# EasyEDA Pro project ProPrj_基于STM32单片机自带校准和温湿度补偿报警的超声波测距仪_2025-01-02.epro, board PCB
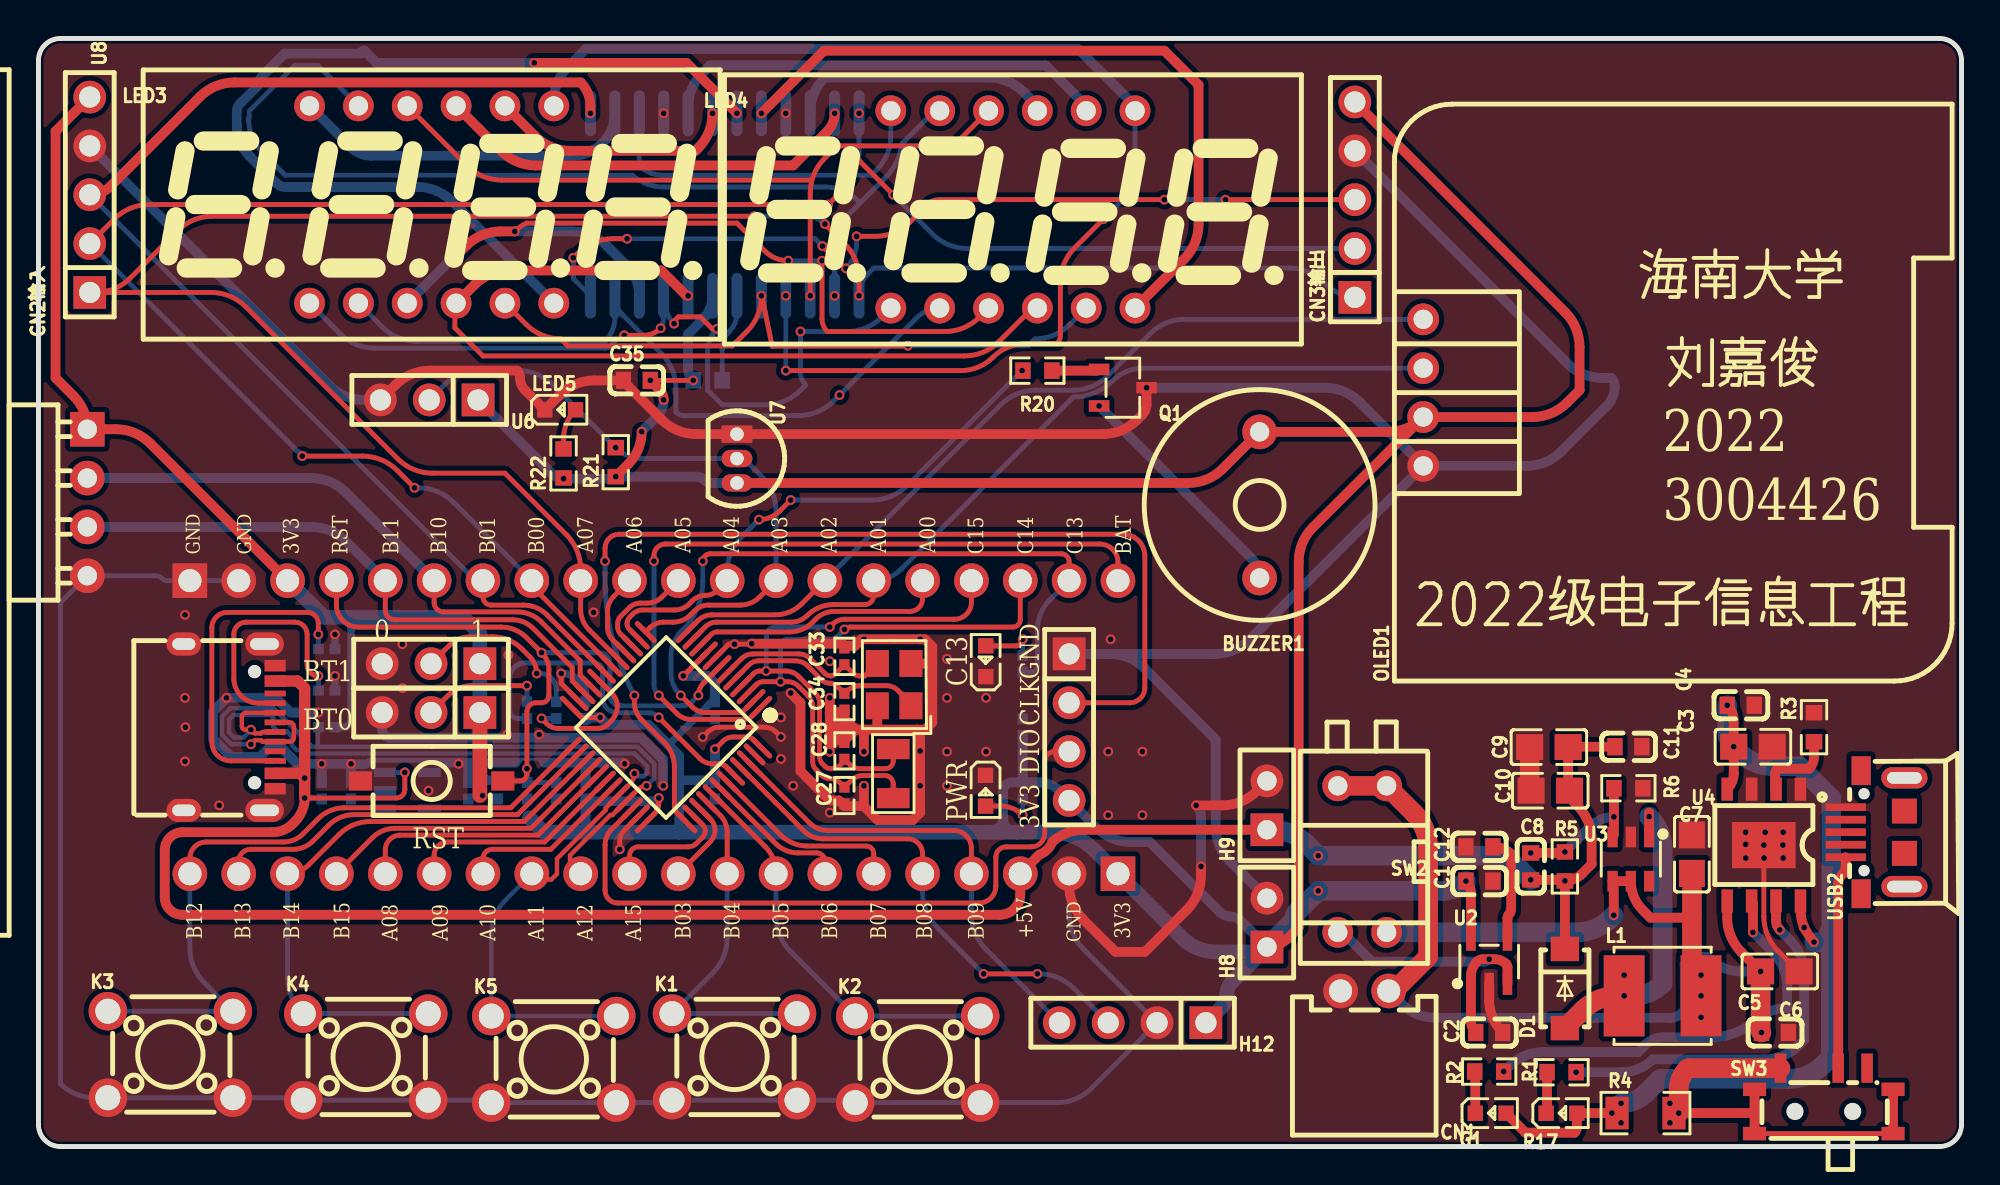
[diagram p1: board, top side]
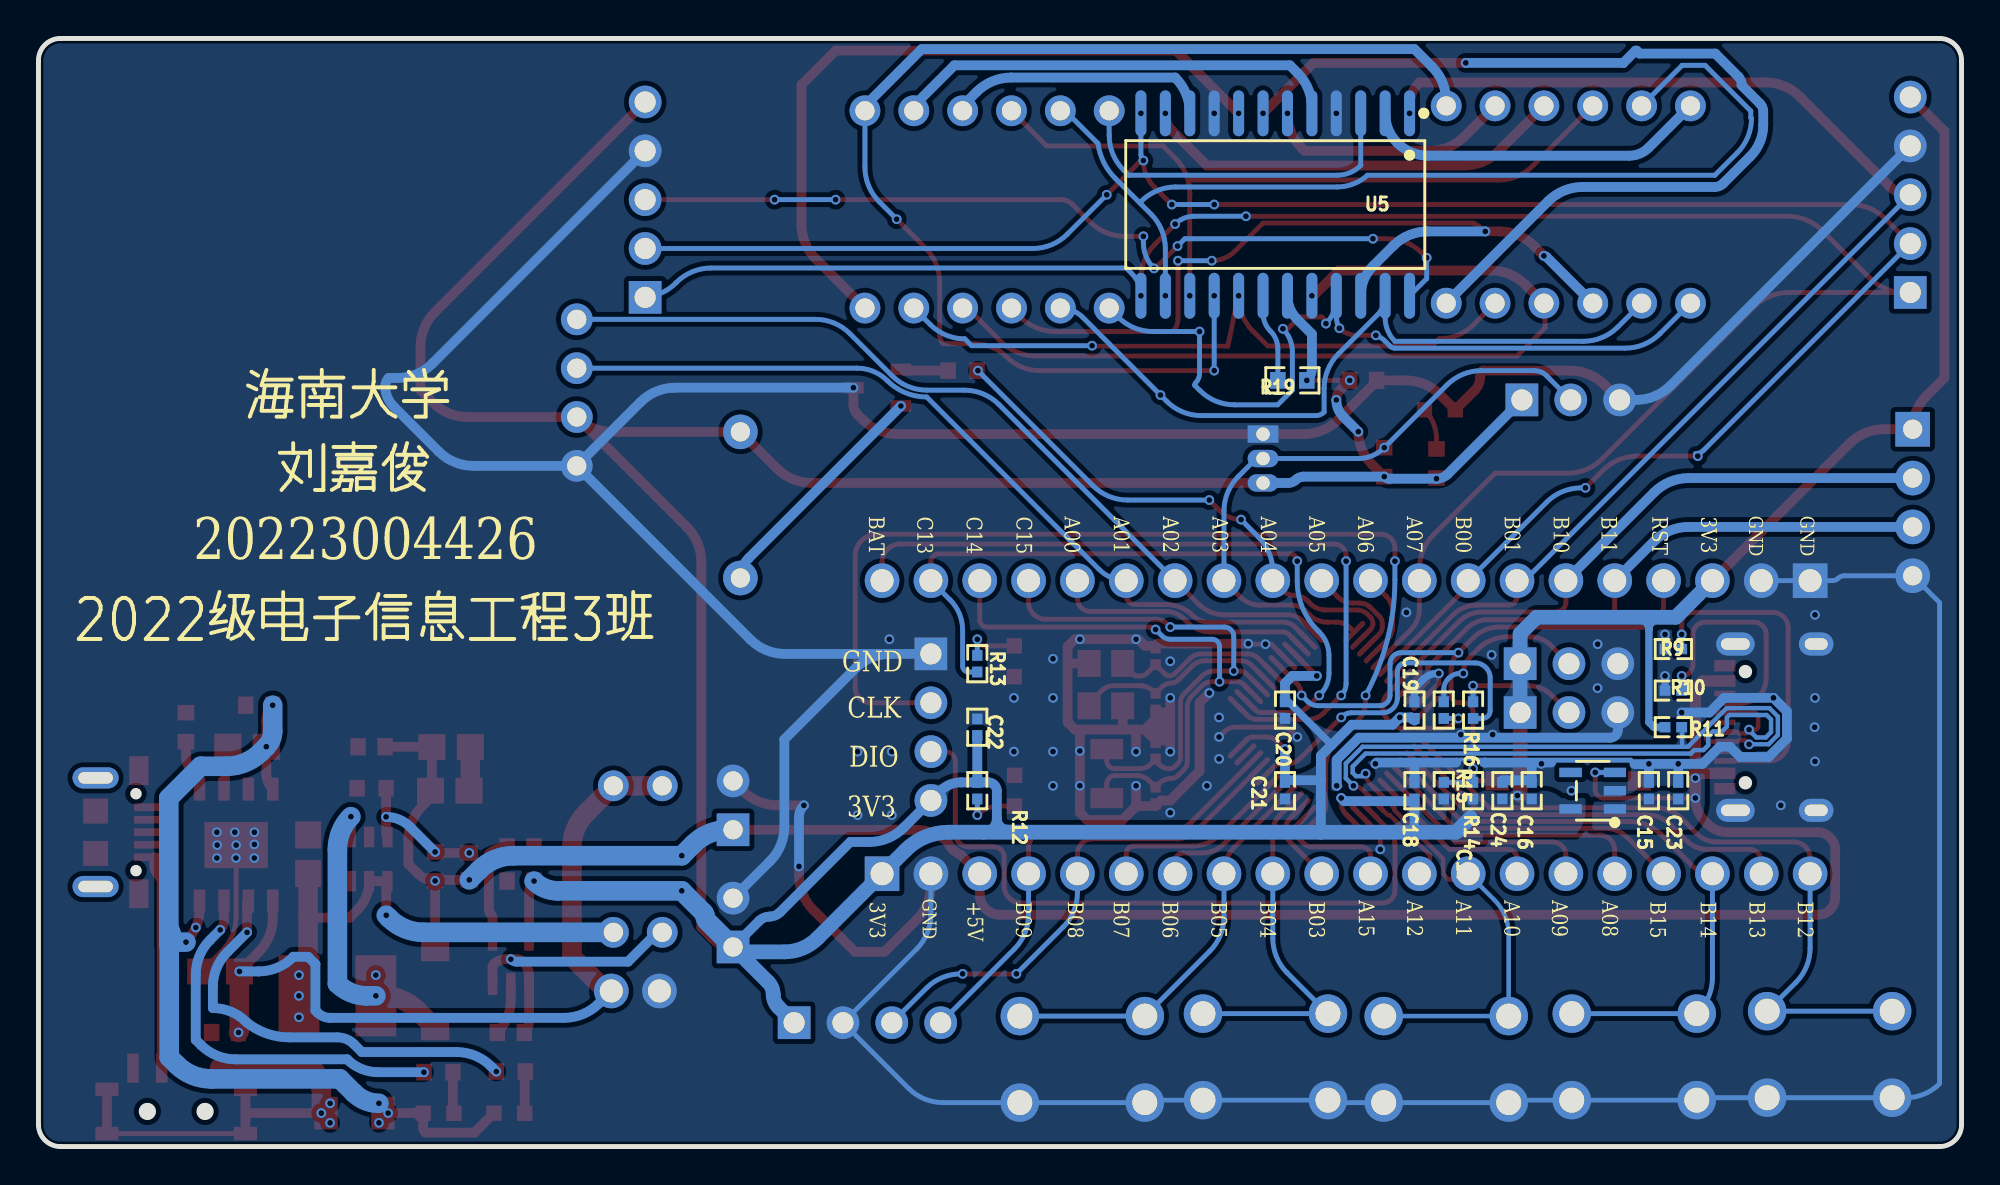
[diagram p2: board, bottom side, seen from below]

Outline 100 x 57.62 mm; copper layers: Top Layer, Bottom Layer. Coordinates in mm from the lower left corner of the outline.
Outline path: 0,56.48 0,1.14 arc(0.33,0.33) 1.14,0 98.86,0 arc(99.67,0.33) 100,1.14 100,56.48 arc(99.67,57.29) 98.86,57.62 1.14,57.62 arc(0.33,57.29) 0,56.48
Stack: Top Layer 0.035mm - / Dielectric1 1.51mm FR4 er 4.5 / Bottom Layer 0.035mm -

## Design rules (mm)
net USB_D-_PA11: DP1
net USB_D+_PA12: DP1
template: 自定义配置
spacing copperThickness1oz (default): track to track 0.102, other pairs 0.152 to 0.3
spacing copperThickness2oz: track to track 0.203, other pairs 0.152 to 0.3
track width copperThickness1oz (default): min 0.152, default 0.254, max 2.54
track width copperThickness2oz: min 0.152, default 0.254, max 2.54
differential pair differentialPair (default): width min 0.229, default 0.229, max 0.229; gap min 0.127, default 0.127
via viaSize (default): diameter min 0.508, default 0.508, max 0.508; hole min 0.305, default 0.305, max 0.305

## Placement (name value [footprint] x y rotation side)
BUZZER1  2.7kHz  [BUZ-TH_BD12.0-P7.60-D0.6-FD]  63.5 33.36 270 top
C1  1uF  [C0603]  74.93 13.81 180 top
C2  1uF  [C0603]  75.44 5.93 180 top
C3  10uF  [C0805]  89.15 20.79 180 top
C4  100nF  [C0603]  88.52 22.95 180 top
C5  10uF  [C0805]  90.55 9.11 180 top
C6  100nF  [C0603]  90.3 5.93 180 top
C7  22uF  [C0805]  85.98 15.2 270 top
C8  22pF  [C0603]  77.6 14.57 270 top
C9  22uF  [C0805]  78.54 20.77 0 top
C10  22uF  [C0805]  78.61 18.5 0 top
C11  100nF  [C0603]  82.68 20.79 180 top
C12  22nF  [C0603]  74.93 15.58 0 top
C15  100nF  [R0402]  16.26 18.5 270 bottom
C16  100nF  [R0402]  22.35 18.5 270 bottom
C17  100nF  [R0402]  26.92 18.5 90 bottom
C18  100nF  [R0402]  28.45 18.5 270 bottom
C19  100nF  [R0402]  28.45 22.7 270 bottom
C20  100nF  [R0402]  35.18 22.7 90 bottom
C21  100nF  [R0402]  35.18 18.5 90 bottom
C22  100nF  [R0402]  51.18 21.81 270 bottom
C23  1uF  [R0402]  14.73 18.5 270 bottom
C24  1uF  [R0402]  23.88 18.5 270 bottom
C27  12pF  [R0402]  41.91 18.25 90 top
C28  12pF  [R0402]  41.91 20.58 270 top
C33  12pF  [R0402]  41.91 25.49 270 top
C34  12pF  [R0402]  41.91 23.13 270 top
C35  100nF  [C0603]  31.12 39.84 0 top
CN1  XH-2AW  [CONN-TH_2P-P2.50_XH-2AW]  68.96 8.09 180 top
CN2输入  HC-PZ254-11.5L-1x5PZ  [HDR-TH_5P-P2.54-V-M]  2.67 49.49 90 top
CN3输出  HC-PZ254-11.5L-1x5PZ  [HDR-TH_5P-P2.54-V-M]  68.45 49.24 90 top
D1  SS34  [DO-214AC_L4.3-W2.7-LS5.3-FD]  79.38 8.22 90 top
G1  NCD0603G1  [LED_0603]  75.56 1.74 0 top
H1  DZ254W-11-04-65  [HDR-TH_4P-P2.54-V-M]  53.59 21.81 270 top
H2  2.54-1*20P直针  [HDR-TH_20P-P2.54-V-M-1]  32 29.43 0 top
H3  PZ254V-11-03P  [HDR-TH_3P-P2.54-V-M]  20.41 22.57 180 top
H4  PZ254V-11-03P  [HDR-TH_3P-P2.54-V-M]  20.41 25.11 180 top
H5  2.54-1*20P直针  [HDR-TH_20P-P2.54-V-M-1]  32 14.19 180 top
H8  2.54-1*2P母  [HDR-TH_2P-P2.54-V-F]  63.88 11.65 90 top
H9  2.54-1*2P母  [HDR-TH_2P-P2.54-V-F]  63.88 17.74 90 top
H12  2.54-1*4P母  [HDR-TH_4P-P2.54-V-F]  56.9 6.44 180 top
K1  TSWDIP-6*6*6  [KEY-TH_4P-L6.0-W6.0-P4.50-LS6.50]  36.19 4.66 0 top
K2  TSWDIP-6*6*6  [KEY-TH_4P-L6.0-W6.0-P4.50-LS6.50]  45.72 4.53 0 top
K3  TSWDIP-6*6*6  [KEY-TH_4P-L6.0-W6.0-P4.50-LS6.50]  6.86 4.79 0 top
K4  TSWDIP-6*6*6  [KEY-TH_4P-L6.0-W6.0-P4.50-LS6.50]  17.02 4.66 0 top
K5  TSWDIP-6*6*6  [KEY-TH_4P-L6.0-W6.0-P4.50-LS6.50]  26.8 4.53 0 top
L1  2.2uH  [IND-SMD_L5.0-W5.0]  84.46 7.84 0 top
LDO1  ME6211C33M5G-N  [SOT-23-5_L3.0-W1.7-P0.95-LS2.8-BL]  19.18 18.5 90 bottom
LED1  NCD0603R1  [LED_0603]  49.25 18.45 270 top
LED2  NCD0603B1  [LED_0603]  49.25 25.29 90 top
LED3  MHDA3641SRBW  [LED-SEG-TH_12P-L30.0-W14.0-P2.54-S10.26-BL]  20.45 48.98 0 top
LED4  MHDA3641SRBW  [LED-SEG-TH_12P-L30.0-W14.0-P2.54-S10.26-BL]  50.67 48.73 0 top
LED5  KT-0603R  [LED_0603]  27.18 38.32 0 top
OLED1  HS96L03W2C03  [0.96OLED_4P]  72.01 39.2 90 top
Q1  S8550  [SOT-23-3_L2.9-W1.6-P1.90-LS2.8-BR]  56.39 39.46 180 top
R1  3.3kΩ  [R0603_NEW]  79.2 3.87 0 top
R2  10kΩ  [R0603_NEW]  75.44 3.9 0 top
R3  1.2kΩ  [R0603_NEW]  92.33 21.81 270 top
R4  250mΩ  [R1206]  83.57 1.74 180 top
R5  440kΩ  [R0603_NEW]  79.38 14.57 90 top
R6  60kΩ  [R0603_NEW]  82.68 18.63 180 top
R9  5.1kΩ  [R0402]  14.99 25.87 0 bottom
R10  5.1kΩ  [R0402]  14.99 23.71 0 bottom
R11  1.5kΩ  [R0402]  14.99 21.81 0 bottom
R12  1kΩ  [R0402]  51.18 18.5 90 bottom
R13  1kΩ  [R0402]  51.18 25.11 270 bottom
R14  10kΩ  [R0402]  25.4 18.5 270 bottom
R15  10kΩ  [R0402]  26.92 22.7 90 bottom
R16  10kΩ  [R0402]  25.4 22.7 270 bottom
R17  KT-0603R  [LED_0603]  79.25 1.74 0 top
R19  10kΩ  [R0603]  34.8 39.84 0 bottom
R20  1kΩ  [R0603]  51.94 40.35 0 top
R21  10kΩ  [R0603]  30.02 35.59 90 top
R22  1kΩ  [R0603]  27.31 35.52 90 top
SW1  TS-1101-B-W  [KEY-SMD_2P-L6.0-W3.6-P7.4-LS8.0-L]  20.45 19.01 0 top
SW2  DSDP02LHGET  [SW-TH_DSDP02LHG]  68.83 14.95 180 top
SW3  MSK12C02-HB  [SW-TH_MSK12C02-HB]  92.84 2.38 0 top
U1  STM32F103C8T6  [LQFP-48_L7.0-W7.0-P0.50-LS9.0-BL]  32.64 21.81 135 top
U2  RT9193-33GB  [SOT-23-5_L3.0-W1.7-P0.95-LS2.8-BL]  75.44 9.61 0 top
U3  MST9220BSF  [SOT-23-6_L2.9-W1.6-P0.95-LS2.8-BL]  82.8 14.95 180 top
U4  TP4056-42-ESOP8  [ESOP-8_L4.9-W3.9-P1.27-LS6.0-BL-EP]  89.72 15.68 180 top
U5  MAX7219CWG+  [SOIC-24_L15.4-W7.5-P1.27-LS10.3-BL]  35.69 48.98 0 bottom
U6  HC-PZ254-11.5L-1x3PZ  [HDR-TH_3P-P2.54-V-M]  20.32 38.82 180 top
U7  DS18B20  [TO-92-3_L4.9-W3.7-P1.27-L]  36.32 35.78 270 top
U8  HC-SR04  [TH_HC-SR04V]  2.54 33.49 270 top
USB1  TYPE-C 16PIN 2MD(073)  [USB-C-SMD_TYPE-C-6PIN-2MD-073]  9.93 21.81 270 top
USB2  MICRO5.9mmusb  [MICRO-USB-SMD_5P-P0.65-H-F_MICRO5.9MMUSB]  95.5 16.34 90 top
X3  8MHz  [CRYSTAL-SMD_4P-L3.2-W2.5-BL-1]  44.5 24.02 90 top
X5  32.768kHz  [OSC-SMD_L3.2-W1.5]  44.45 19.39 90 top

## Footprints (pads in the part's own frame, mm; a bottom-side part is the same pattern mirrored in y, then rotated)
0.96OLED_4P
  round 1.65 hole 1: 1(-3.81,-0.002) 2(-1.27,0.002) 3(1.27,0.002) 4(3.81,0.002)
BUZ-TH_BD12.0-P7.60-D0.6-FD
  round 1.8 hole 1: 1(-3.8,0) 2(3.8,0)
C0603
  rect 0.8x0.9 smd: 1(-0.7,0) 2(0.7,0)
C0805
  rect 1.41x1.35 smd: 1(-1,0) 2(1,0)
CONN-TH_2P-P2.50_XH-2AW
  round 1.8 hole 1.199: 1(-1.251,0) 2(1.251,0)
CRYSTAL-SMD_4P-L3.2-W2.5-BL-1
  rect 1.4x1.2 smd: 1(-1.1,-0.875) 2(1.1,-0.875) 3(1.1,0.875) 4(-1.1,0.875)
DO-214AC_L4.3-W2.7-LS5.3-FD
  rect 1.27x1.47 smd: 1(-2.058,0) 2(2.058,0)
ESOP-8_L4.9-W3.9-P1.27-LS6.0-BL-EP
  rect 0.6x1.2 smd: 1(-1.905,-2.909) 2(-0.635,-2.909) 3(0.635,-2.909) 4(1.905,-2.909) 5(1.905,2.909) 6(0.635,2.909) 7(-0.635,2.909) 8(-1.905,2.909)
  rect 3.3x2.4 smd: 9(0,0)
HDR-TH_2P-P2.54-V-F
  rect 1.7x1.7 hole 1: 1(-1.27,0)
  round 1.7 hole 1: 2(1.27,0)
HDR-TH_3P-P2.54-V-M
  rect 1.7x1.7 hole 1.1: 1(-2.54,0)
  round 1.7 hole 1.1: 2(0,0) 3(2.54,0)
HDR-TH_4P-P2.54-V-F
  rect 1.7x1.7 hole 1.1: 1(-3.81,0)
  round 1.7 hole 1.1: 2(-1.27,0) 3(1.27,0) 4(3.81,0)
HDR-TH_4P-P2.54-V-M
  rect 1.7x1.7 hole 1.1: 1(-3.81,0)
  round 1.7 hole 1.1: 2(-1.27,0) 3(1.27,0) 4(3.81,0)
HDR-TH_5P-P2.54-V-M
  rect 1.7x1.7 hole 1.1: 1(-5.08,0)
  round 1.7 hole 1.1: 2(-2.54,0) 3(0,0) 4(2.54,0) 5(5.08,0)
HDR-TH_20P-P2.54-V-M-1
  rect 1.8x1.8 hole 1.2: 1(-24.13,0)
  round 1.8 hole 1.2: 2(-21.59,0) 3(-19.05,0) 4(-16.51,0) 5(-13.97,0) 6(-11.43,0) 7(-8.89,0) 8(-6.35,0) 9(-3.81,0) 10(-1.27,0) 11(1.27,0) 12(3.81,0) 13(6.35,0) 14(8.89,0) 15(11.43,0) 16(13.97,0) 17(16.51,0) 18(19.05,0) 19(21.59,0) 20(24.13,0)
IND-SMD_L5.0-W5.0
  rect 2.124x4.22 smd: 1(2,0) 2(-2,0)
KEY-SMD_2P-L6.0-W3.6-P7.4-LS8.0-L
  rect 1.2x1 smd: 1(-3.7,0) 2(3.7,0)
KEY-TH_4P-L6.0-W6.0-P4.50-LS6.50
  round 2 hole 1.3: 1(-3.25,2.25) 2(3.25,2.25) 3(-3.25,-2.25) 4(3.25,-2.25)
LED-SEG-TH_12P-L30.0-W14.0-P2.54-S10.26-BL
  round 1.6 hole 1: 1(-6.35,-5.13) 2(-3.81,-5.13) 3(-1.27,-5.13) 4(1.27,-5.13) 5(3.81,-5.13) 6(6.35,-5.13) 7(6.35,5.13) 8(3.81,5.13) 9(1.27,5.13) 10(-1.27,5.13) 11(-3.81,5.13) 12(-6.35,5.13)
LED_0603
  rect 0.8x0.8 smd: 1(-0.851,-0.01) 2(0.75,-0.005)
LQFP-48_L7.0-W7.0-P0.50-LS9.0-BL
  oval 0.27x1.5 smd: 1(-2.75,-4.25) 2(-2.25,-4.25) 3(-1.75,-4.25) 4(-1.25,-4.25) 5(-0.75,-4.25) 6(-0.25,-4.25) 7(0.25,-4.25) 8(0.75,-4.25) 9(1.25,-4.25) 10(1.75,-4.25) 11(2.25,-4.25) 12(2.75,-4.25) 25(2.75,4.25) 26(2.25,4.25) 27(1.75,4.25) 28(1.25,4.25) 29(0.75,4.25) 30(0.25,4.25) 31(-0.25,4.25) 32(-0.75,4.25) 33(-1.25,4.25) 34(-1.75,4.25) 35(-2.25,4.25) 36(-2.75,4.25)
  oval 1.5x0.27 smd: 13(4.25,-2.75) 14(4.25,-2.25) 15(4.25,-1.75) 16(4.25,-1.25) 17(4.25,-0.75) 18(4.25,-0.25) 19(4.25,0.25) 20(4.25,0.75) 21(4.25,1.25) 22(4.25,1.75) 23(4.25,2.25) 24(4.25,2.75) 37(-4.25,2.75) 38(-4.25,2.25) 39(-4.25,1.75) 40(-4.25,1.25) 41(-4.25,0.75) 42(-4.25,0.25) 43(-4.25,-0.25) 44(-4.25,-0.75) 45(-4.25,-1.25) 46(-4.25,-1.75) 47(-4.25,-2.25) 48(-4.25,-2.75)
MICRO-USB-SMD_5P-P0.65-H-F_MICRO5.9MMUSB
  rect 0.4x2.1 smd: 1(-1.3,1.525) 2(-0.65,1.525) 3(0,1.525) 4(0.65,1.525) 5(1.3,1.525)
  rect 1.5x1 smd: 6(-3.2,0.725) 6(3.2,0.725)
  oval 1.1x2.4 hole 0.6x1.8: 6(-2.825,-1.525) 6(2.825,-1.525)
  rect 1.3x1.3 smd: 6(-1.1,-1.525) 6(1.1,-1.525)
OSC-SMD_L3.2-W1.5
  rect 1.05x1.7 smd: 1(-1.275,0) 2(1.275,0)
R0402
  rect 0.566x0.54 smd: 1(-0.433,0) 2(0.433,0)
R0603
  rect 0.806x0.864 smd: 1(-0.753,0) 2(0.753,0)
R0603_NEW
  rect 0.806x0.864 smd: 1(-0.753,0) 2(0.753,0)
R1206
  rect 1.208x1.701 smd: 1(-1.479,0) 2(1.479,0)
SOIC-24_L15.4-W7.5-P1.27-LS10.3-BL
  oval 0.574x2.388 smd: 1(-6.985,-4.744) 2(-5.715,-4.744) 3(-4.445,-4.744) 4(-3.175,-4.744) 5(-1.905,-4.744) 6(-0.635,-4.744) 7(0.635,-4.744) 8(1.905,-4.744) 9(3.175,-4.744) 10(4.445,-4.744) 11(5.715,-4.744) 12(6.985,-4.744) 13(6.985,4.744) 14(5.715,4.744) 15(4.445,4.744) 16(3.175,4.744) 17(1.905,4.744) 18(0.635,4.744) 19(-0.635,4.744) 20(-1.905,4.744) 21(-3.175,4.744) 22(-4.445,4.744) 23(-5.715,4.744) 24(-6.985,4.744)
SOT-23-3_L2.9-W1.6-P1.90-LS2.8-BR
  rect 1.07x0.6 smd: 1(1.235,-0.95) 2(1.235,0.95) 3(-1.235,0)
SOT-23-5_L3.0-W1.7-P0.95-LS2.8-BL
  rect 0.49x1.157 smd: 1(-0.95,-1.153) 2(0,-1.153) 3(0.95,-1.153)
  rect 0.49x1.175 smd: 4(0.95,1.153) 5(-0.95,1.153)
SOT-23-6_L2.9-W1.6-P0.95-LS2.8-BL
  rect 0.532x1.072 smd: 1(-0.95,-1.149) 2(0,-1.149) 3(0.95,-1.149) 4(0.95,1.149) 5(0,1.149) 6(-0.95,1.149)
SW-TH_DSDP02LHG
  round 1.6 hole 1: 1(-1.27,-3.81) 2(1.27,-3.81) 3(1.27,3.81) 4(-1.27,3.81)
SW-TH_MSK12C02-HB
  rect 0.6x1.524 smd: 1(-2.25,1.7) 2(0.75,1.7) 3(2.25,1.7)
  rect 1.2x0.7 smd: 4(-3.6,0.6) 4(-3.6,-1.7) 4(3.6,0.6) 4(3.6,-1.7)
TH_HC-SR04V
  rect 1.8x1.8 hole 1.001: 1(-3.81,0)
  round 1.8 hole 1.001: 2(-1.27,0) 3(1.27,0) 4(3.81,0)
TO-92-3_L4.9-W3.7-P1.27-L
  rect 0.9x1.6 hole 0.7: 1(-1.27,0)
  oval 0.9x1.6 hole 0.7: 2(0,0) 3(1.27,0)
USB-C-SMD_TYPE-C-6PIN-2MD-073
  rect 0.6x1.1 smd: 1(-3.2,2.375) 2(-2.4,2.375) 11(2.4,2.375) 12(3.2,2.375)
  rect 0.3x1.1 smd: 3(-1.75,2.375) 4(-1.25,2.375) 5(-0.75,2.375) 6(-0.25,2.375) 7(0.25,2.375) 8(0.75,2.375) 9(1.25,2.375) 10(1.75,2.375)
  oval 1.2x2 hole 0.6x1.5: 13(-4.325,1.825) 14(4.325,1.825)
  oval 1.2x1.8 hole 0.6x1.2: 13(-4.325,-2.375) 14(4.325,-2.375)

## Nets
As in the schematic, except:
3V3: BUZZER1.1 C1.2 C16.2 C18.2 C19.2 C20.2 C21.2 C22.2 C24.2 C35.2 CN2输入.5 CN3输出.5 H1.4 H2.3 H3.1 H4.1 H5.1 H8.1 H12.1 LDO1.5 OLED1.2 R11.2 R12.2 R14.2 R19.1 R21.1 R22.1 U1.9 U1.24 U1.36 U1.48 U2.5 U5.19 U6.1 U7.3 U8.1
GND: C1.1 C2.1 C3.1 C4.1 C5.1 C6.1 C7.1 C9.1 C10.1 C11.1 C12.1 C15.1 C16.1 C17.1 C18.1 C19.1 C20.1 C21.1 C22.1 C23.1 C24.1 C27.1 C28.1 C33.1 C34.2 C35.1 CN1.2 CN2输入.4 CN3输出.4 H1.1 H2.1 H2.2 H3.3 H4.3 H5.2 H8.2 H9.2 H12.2 K1.3 K1.4 K2.3 K2.4 K3.3 K3.4 K4.3 K4.4 K5.3 K5.4 LDO1.2 LED1.1 LED2.1 LED5.1 OLED1.1 Q1.3 R3.1 R6.1 R9.2 R10.2 SW1.1 U1.8 U1.23 U1.35 U1.47 U2.2 U3.2 U4.1 U4.3 U4.9 U5.4 U5.9 U6.3 U7.1 U8.4 USB1.1 USB1.12 USB1.13 USB1.14 USB2.5 X3.2 X3.4
PA1: H2.15 OLED1.3 U1.11
PA2: H2.14 OLED1.4 U1.12
R1_1: R1.1 R17.1
R2_1: G1.1 R2.1
U1_4: C3.2 C4.2 G1.2 R4.2 R17.2 U4.4 U4.8
USB_5V: R4.1 SW3.1 SW3.4

Pads without a net: LDO1 4; SW3 3; U3 6; USB1 3 9; USB2 2 3 4 6

## Via types
v1: diameter 0.508, hole 0.305, Top Layer to Bottom Layer, 185 vias

## Routing (per net, layer and track width the routed paths; a pad name or vN(x,y) marks a point on that pad's centre or on a via; arc(x,y) is an arc through that point)
3V3: length 302.6
  Top Layer w0.254: U1.48 37.17,21.17 arc(37.02,21.26) 36.85,21.3 36.13,21.3 arc(35.84,21.24) 35.59,21.08 v1(35.18,20.66) ; U1.36 32.03,17.31 arc(32.2,17.56) 32.26,17.85 v1(32.26,18.12) ; U1.24 28.24,22.31 v1(29.21,22.31) ; v1(31.81,39.84) v1(34.04,39.84)
  Top Layer w0.28: v1(33.53,24.47) 33.54,24.47 U1.9
  Top Layer w0.508: 71.98,37.91 66.28,32.2 arc(65.73,31.38) 65.53,30.41 65.53,11.39 64.97,10.83 arc(64.47,10.49) H8.1 ; 71.98,37.91 OLED1.2 77.69,37.94 arc(78.66,38.13) 79.48,38.68 80.14,39.33 80.14,41.58 arc(79.94,42.55) 79.39,43.38 CN3输出.5 ; 71.98,37.91 arc(71.16,37.36) 70.18,37.16 63.5,37.16 61.59,35.25 arc(60.76,34.7) 59.79,34.51 U7.3 ; H2.3 5.82,36.56 arc(5,37.11) 4.03,37.3 U8.1 arc(2.35,38.24) 1.82,39.03 0.89,39.97 0.89,52.78 arc(0.89,52.79) 0.9,52.8 CN2输入.5 ; v1(31.81,39.84) 32.29,39.37 arc(32.45,39.12) v1(32.51,38.82) ; v1(30.02,34.84) 30.67,35.49 arc(31.19,36.26) v1(31.37,37.17) ; U2.5 74.49,13.18 arc(74.42,13.52) v1(74.23,13.81)
  Top Layer w0.762: H3.1 22.95,18.25
  Bottom Layer w0.381: 15.42,21.81 16,21.81 16.26,22.06 16.26,26.89 ; 16.26,27.01 16.26,27.39 ; 16.26,27.01 16.26,26.89 ; 16.26,27.01 arc(16.14,27.28) 15.88,27.39 ; 16.26,26.89 arc(16.11,27.25) 15.75,27.39 ; 16.26,26.89 arc(16.4,27.25) 16.76,27.39 ; 35.18,23.24 35.11,23.24 32.77,20.89 32.77,20.87
  Bottom Layer w0.508: R12.2 50.61,18.94 arc(50.3,18.81) 50.16,18.49 50.16,17.05 ; R12.2 51.18,21.26 ; R12.2 52.03,18.94 arc(52.61,18.82) 53.09,18.5 H1.4 55.01,16.58 arc(55.83,16.03) 56.81,15.84 57.78,15.84 61.44,12.18 arc(61.69,12.02) 61.98,11.96 arc(62.27,11.9) 62.52,11.73 H8.1 ; 33.32,19.04 33.32,19.05 35.18,19.05 v1(35.18,20.66) ; 33.32,19.04 33.32,20.32 31.7,21.93 29.59,21.93 v1(29.21,22.31) 28.61,22.31 28.45,22.15 ; 33.32,19.04 33.32,16.34 ; U6.1 26.71,34.97 arc(26.98,34.79) v1(27.31,34.73) 29.76,34.73 arc(29.9,34.76) v1(30.02,34.84) 34.22,34.84 arc(34.43,34.79) 34.62,34.67 arc(34.8,34.55) 35.01,34.51 U7.3 ; 49.4,16.47 49.59,16.47 arc(50,16.64) 50.16,17.05 ; 28.45,16.34 28.45,17.96 32.09,17.96 v1(32.26,18.12) ; 35.18,23.24 35.18,24.09 34.8,24.47 v1(33.53,24.47) ; v1(31.37,37.17) 32.15,37.96 arc(32.42,38.35) v1(32.51,38.82) ; 50.16,17.05 50.16,16.47 ; 50.16,17.05 arc(50.37,16.55) 50.87,16.34 ; v1(34.04,39.84) arc(33.85,40.13) 33.78,40.47 33.78,42.25 34.55,43.02 arc(34.92,43.58) U5.19
  Bottom Layer w0.762: H2.3 14.86,27.52 22.1,27.52 22.95,26.67 H4.1 H3.1 ; H12.1 61.53,7.26 arc(61.72,7.56) 61.79,7.91 arc(61.86,8.26) 62.06,8.56 H8.1 arc(63.6,10.19) 63.27,10.12 61.21,10.12 arc(60.28,10.31) 59.48,10.84 H5.1 54.9,15.42 arc(53.88,16.11) 52.67,16.34 26.29,16.34 25.53,17.11
  Bottom Layer w1.016: H8.1 65.24,11.73 arc(65.31,11.83) 65.33,11.95 arc(65.35,12.07) 65.42,12.17 v1(66.55,13.3) 73,13.3 arc(73.67,13.43) v1(74.23,13.81)
  vias: v1(23.1,18.25)
+5V: length 118.6
  Top Layer w0.254: v1(13.84,18.12) 18.61,18.12 arc(18.92,18.25) 19.05,18.56 v1(19.05,19.45)
  Top Layer w0.508: H9.1 54.39,16.47 arc(53.5,16.31) 52.73,15.85 arc(52.46,15.44) 52.04,15.18 H5.3 51.05,13.11 arc(50.75,12.36) 50,12.05 7.47,12.05 arc(6.83,12.32) 6.57,12.95 6.57,15.42 arc(6.84,16.07) 7.49,16.34 12.17,16.34 arc(12.74,16.46) 13.21,16.78 13.34,16.9 arc(13.71,17.46) v1(13.84,18.12) ; v1(77.6,13.87) 79.25,13.87 arc(79.32,13.85) v1(79.38,13.81) ; C11.2 79.59,20.79 arc(79.56,20.79) C9.2 79.54,18.67 arc(79.56,18.58) C10.2 arc(79.68,18.17) 79.87,17.88 80.03,17.73 arc(80.58,16.9) 80.77,15.93 80.77,15.92 80.77,14.69 80.26,14.18 arc(79.85,13.91) v1(79.38,13.81) ; D1.2 v1(79.38,13.81)
  Top Layer w0.584: v1(13.84,19.16) 13.6,19.41 USB1.11 ; v1(13.84,19.16) 13.84,23.84 13.48,24.21 USB1.2 ; v1(13.84,19.16) v1(13.84,18.12)
  Bottom Layer w0.254: LDO1.3 v1(19.05,19.45) 19.05,19.39
  Bottom Layer w1.016: H9.1 64.15,16.47 arc(65.12,16.28) 65.94,15.73 v1(66.55,15.12) 75.29,15.12 arc(76.26,14.93) 77.08,14.38 v1(77.6,13.87)
GND: length 400.7
  Top Layer w0.254: v1(27.18,24.6) 27.18,24.08 U1.23 ; v1(38.61,21.3) 38.33,21.58 arc(38.08,21.75) 37.78,21.81 35.38,21.81 arc(35.08,21.75) 34.82,21.57 v1(34.54,21.3) ; v1(37.09,26.15) 37.06,26.12 v1(36.19,26.12) 35.9,26.12 U1.8 ; v1(89.72,15.68) 89.72,11.96 arc(89.91,10.99) 90.46,10.16 91.5,9.13 arc(91.52,9.11) C5.1 ; v1(30.23,15.46) 30.23,15.86 arc(30.29,16.18) 30.47,16.46 31.23,17.21
  Top Layer w0.508: 45.69,21.68 45.85,21.52 v1(45.85,20.57) v1(45.85,18.76) 45.85,17.36 45.47,16.98 43.64,16.98 42.91,17.71 ; 45.69,21.68 43.63,21.68 ; 45.69,21.68 46.1,21.68 46.48,22.06 46.48,25.13 ; 41.81,22.59 41.2,22.59 41.15,22.53 ; 41.81,22.59 41.91,22.59 ; 41.81,22.59 arc(41.86,22.64) C34.2 41.91,22.59 ; 41.81,22.59 arc(41.6,22.21) 41.53,21.78 41.53,21.43 ; 46.48,25.13 46.48,26 46.1,26.38 v1(45.85,26.38) 42.8,26.38 42.46,26.03 41.91,26.03 41.79,26.15 v1(37.09,26.15) ; 46.48,25.13 arc(46.47,25.12) 46.46,25.12 X3.2 ; 42.91,17.71 41.91,17.71 41.62,18 41.15,18 39.62,19.52 39.62,23.08 v1(39.12,23.58) ; 42.91,17.71 42.93,17.72 v1(42.93,18.76) ; U6.3 18.56,39.6 arc(19.38,40.15) 20.36,40.35 24.89,40.35 arc(25,40.19) 25.04,40 arc(25.11,39.63) 25.32,39.31 LED5.1 27.12,39.1 arc(27.94,39.65) 28.91,39.84 C35.1 arc(30.42,39.79) 30.45,39.75 32.42,37.79 arc(33.24,37.24) 34.21,37.05 U7.1 55.34,37.05 arc(56.31,37.24) 57.13,37.79 57.4,38.06 arc(57.57,38.3) 57.62,38.59 v1(57.62,39.46) ; H5.2 53.59,13.59 arc(53.79,12.61) 54.34,11.79 56.01,10.12 57.53,10.12 59.71,12.3 arc(60.26,13.12) 60.45,14.09 v1(60.45,14.57) ; 41.91,22.59 41.91,22.24 ; 41.91,22.24 41.91,21.12 ; 41.91,22.24 42.47,21.68 ; 41.15,22.53 41.15,21.13 ; 41.15,22.53 v1(41.15,23.33) ; X3.4 43.62,21.71 arc(43.62,21.69) 43.63,21.68 ; v1(60.2,17.74) 61.56,17.74 arc(62.53,17.94) 63.35,18.49 H9.2 ; 43.63,21.68 42.93,21.68 ; U2.2 75.44,7.62 arc(75.62,6.71) C2.1 ; 41.15,21.13 41.16,21.12 41.91,21.12 ; 41.15,21.13 v1(41.15,20.54) ; 42.93,21.68 42.93,21.67 v1(42.93,20.54) ; 42.93,21.68 42.47,21.68 ; 41.91,21.12 42.47,21.68
  Top Layer w1.016: C9.1 77.54,18.67 arc(77.56,18.58) C10.1
  Bottom Layer w0.152: 25.99,20.14 26.14,20 26.16,20 ; 25.99,20.14 25.15,20.14 ; 25.99,20.14 26.29,20.14 26.29,19.96 ; 25.15,20.14 24.77,20.14 24.77,19.96 ; 25.15,20.14 24.99,19.98
  Bottom Layer w0.254: H2.2 H2.1 6.72,29.43 arc(6.55,29.46) 6.41,29.55 arc(6.27,29.65) 6.11,29.68 U8.4 1.15,28.29 arc(1.14,28.28) 1.14,28.28 1.14,3.26 arc(1.95,2.73) 2.9,2.54 K3.3 K3.4 13.46,2.54 arc(13.63,2.51) K4.3 K4.4 23.24,2.41 arc(23.41,2.38) K5.3 K5.4 32.64,2.28 arc(32.8,2.32) 32.95,2.41 K1.4 42.16,2.41 arc(42.33,2.38) K2.3 K2.4 52.96,2.28 arc(53.93,2.48) 54.75,3.03 H12.2 54.34,10.27 arc(53.79,11.09) 53.59,12.06 H5.2 ; 16.89,19.77 17.21,20.09 21.21,20.09 21.34,19.96
  Bottom Layer w0.381: 15.42,25.87 v1(15.42,26.63) ; 28.45,23.24 28.45,23.66 arc(28.41,23.82) 28.32,23.97 27.98,24.31 arc(27.65,24.52) 27.28,24.6 v1(27.18,24.6) ; 15.42,23.71 v1(15.42,24.47)
  Bottom Layer w0.508: 72.01,35.4 77.39,35.4 arc(78.36,35.59) 79.19,36.14 81.53,38.49 arc(81.85,38.97) 81.97,39.53 arc(81.92,39.77) 81.79,39.97 81.32,39.97 arc(80.34,40.16) 79.52,40.71 CN3输出.4 ; 72.01,35.4 62.97,26.36 arc(62.15,25.81) 61.18,25.62 55.72,25.62 ; 72.01,35.4 68.69,38.72 arc(67.87,39.27) 66.89,39.46 v1(57.62,39.46) ; 28.44,19.96 30.42,19.96 v1(30.48,19.9) ; 28.44,19.96 26.29,19.96 ; 28.44,19.96 28.45,19.96 28.45,19.05 ; 16.26,19.05 v1(16.26,19.9) ; v1(16.26,19.9) 16.27,19.89 17,19.89 ; v1(16.26,19.9) v1(14.73,19.9) ; H1.1 55.72,25.62 ; 55.72,25.62 arc(56.69,25.42) 57.51,24.87 61.21,21.17 61.21,16.64 arc(61.41,15.66) 61.96,14.84 H8.2 ; 14.73,19.05 v1(14.73,19.9) ; v1(14.73,19.9) 13.46,19.9 12.57,20.79 12.04,20.79 11.51,20.26 10.03,20.26 9.08,21.2 9.08,22.63 v1(9.78,23.33) 12.35,23.33 13.11,22.57 v1(14.55,22.57) ; 23.88,19.05 22.35,19.05 22.35,19.9 ; 24.82,19.96 21.34,19.96 ; U6.3 16.93,38.82 arc(15.96,39.02) 15.13,39.57 CN2输入.4 ; v1(60.45,14.57) 60.45,17.13 arc(60.39,17.46) v1(60.2,17.74) ; v1(32.49,18.76) 32.49,18.76 32.49,20.12 31.34,21.26 18.28,21.26 arc(17.99,21.38) 17.87,21.66 H3.3
  vias: v1(7.62,27.65) v1(7.62,23.33) v1(7.64,21.81) v1(7.62,20.03) v1(9.4,17.74) v1(18.92,26.12) v1(18.93,23.84) v1(20.29,18.5) v1(21.84,19.9) v1(24.38,21.43) v1(24.43,25.56) v1(26.03,21.43) v1(28.87,27.78) v1(32.51,53.73) v1(38.61,22.31) v1(38.61,20.16) v1(38.86,53.73) v1(39.24,18.76) v1(41.15,25.23) v1(41.15,17.36) v1(42.93,26.38) v1(47.24,25.36) v1(47.24,23.33) v1(47.24,20.54) v1(47.24,18.76) v1(49.28,23.33) v1(49.28,20.54) v1(55.63,20.54) v1(55.63,17.23) v1(55.75,26.38) v1(57.4,20.54) v1(57.4,17.23) v1(88.77,16.34) v1(88.77,15.71) v1(88.78,15) v1(89.73,15) v1(89.79,16.34) v1(90.72,16.34) v1(90.71,15.68) v1(90.72,15)
VBAT: length 39.4
  Top Layer w0.254: U1.1 37.1,22.38 arc(36.92,22.26) 36.7,22.21 33.94,22.21 arc(33.54,22.29) 33.19,22.52 v1(32.26,23.46) ; v1(32,30.44) 32,30.72 arc(32.18,31.15) 32.61,31.33 55.19,31.33 arc(55.86,31.05) 56.13,30.38 H2.20
  Bottom Layer w0.254: v1(32,30.44) 32,24.07 arc(32.07,23.74) v1(32.26,23.46)
BAT: length 45.1
  Top Layer w0.508: v1(89.55,9.11) 88.56,10.1 arc(88.01,10.92) 87.82,11.89 U4.5
  Top Layer w1.016: SW2.2 SW2.1 71.52,17.34 arc(72.07,16.52) 72.26,15.55 72.26,9.87 70.68,8.28 arc(70.46,8.14) CN1.1 ; v1(89.55,9.11) 89.55,6.04 arc(89.56,5.98) v1(89.6,5.93)
  Bottom Layer w0.508: v1(89.55,9.11) 88.56,9.11 arc(87.58,9.3) 86.76,9.85 86.74,9.87 85.98,9.87 85.6,9.49 85.6,7.07 85.49,6.96 arc(85.19,6.76) 84.84,6.69 72.66,6.69 arc(71.69,6.89) 70.87,7.44 CN1.1
BAT_1: length 25.7
  Top Layer w0.508: v1(81.91,12.03) 81.91,13.65 arc(81.9,13.73) U3.4 U3.5 arc(82.97,12.98) 83.43,12.29 83.82,11.9 85.6,11.9 arc(85.8,11.94) 85.98,12.06
  Top Layer w1.016: C7.2 85.98,8.98 arc(85.98,8.93) 85.98,8.89 arc(86.12,8.32) v1(86.46,7.84)
  Bottom Layer w1.016: SW2.4 79.97,11.14 arc(80.95,11.33) 81.77,11.88 v1(81.91,12.03)
  vias: v1(86.46,8.91) v1(86.46,6.72)
BAT_2: length 15
  Top Layer w0.508: U2.3 76.39,9.34 arc(76.37,9.42) 76.33,9.49 arc(76.05,9.68) 75.71,9.74 v1(75.44,9.74) 75.11,9.74 arc(74.94,9.71) 74.8,9.61 arc(74.57,9.27) 74.49,8.85 U2.1 74.49,6.53 arc(74.55,6.21) C2.2
  Bottom Layer w0.508: SW2.3 arc(67.8,11.09) 68,10.96 69.34,9.61 75.13,9.61 arc(75.3,9.65) v1(75.44,9.74)
BOOT0: length 18.3
  Top Layer w0.254: U1.44 35.75,19.76 arc(35.59,19.86) 35.4,19.9 35.05,19.9 arc(34.7,19.97) 34.4,20.17 v1(32.26,22.31)
  Bottom Layer w0.254: R16.2 24.91,22.26 arc(24.63,22.38) 24.51,22.66 24.51,24.36 arc(24.74,24.92) 25.29,25.15 28.92,25.15 arc(29.21,25.02) 29.34,24.73 29.34,23.33 arc(29.56,22.78) 30.11,22.56 31.73,22.56 arc(31.99,22.5) 32.22,22.36 v1(32.26,22.31)
BOOT1: length 7.3
  Top Layer w0.254: U1.20 29.82,23.56 arc(30.03,23.26) 30.1,22.9 arc(30.02,22.48) 29.78,22.13 29.58,21.93 arc(29.38,21.79) 29.13,21.75 27,21.75 arc(26.7,21.81) 26.45,21.98 v1(26.16,22.26)
  Bottom Layer w0.254: R15.1 v1(26.16,22.26)
C12_2: length 5.5
  Top Layer w0.508: U2.4 76.39,11.86 arc(76.41,11.99) 76.48,12.1 arc(76.56,12.2) 76.58,12.33 76.58,15.2 arc(76.16,15.48) 75.66,15.58 C12.2
CLK8: length 108.4
  Top Layer w0.254: U1.17 28.63,26.88 arc(28.31,27.36) 28.19,27.93 H2.9 28.19,30.03 arc(28,31) 27.45,31.82 24.26,35.01 20.48,35.01 arc(19.51,35.21) 18.69,35.76 10.78,43.67 arc(9.95,44.22) 8.98,44.41 2.97,44.41 ; v1(42.67,44.24) 42.67,45.14 arc(42.48,46.11) 41.93,46.93 v1(40.89,47.97) ; v1(37.21,48.37) 9.04,48.37 arc(8.07,48.18) 7.24,47.63 4.77,45.16 arc(3.95,44.61) 2.97,44.41 ; CN2输入.1 2.97,44.41
  Bottom Layer w0.254: v1(37.21,48.37) 39.91,48.37 arc(40.44,48.27) v1(40.89,47.97) ; 68.71,44.16 68.66,44.16 arc(67.68,44.35) 66.86,44.9 66.82,44.94 arc(66,45.49) 65.03,45.68 43.43,45.68 43.15,45.4 arc(42.8,44.87) v1(42.67,44.24)
DIG0: length 18.1
  Bottom Layer w0.508: LED3.12 16.27,51.94 arc(16.73,51.63) 17.27,51.52 27.75,51.52 arc(28.6,51.69) 29.33,52.18 arc(29.81,52.89) U5.2
DIG1: length 22.2
  Top Layer w0.508: LED3.9 24.07,51.76 arc(24.9,51.21) 25.87,51.02 39.24,51.02 41.01,52.78 arc(41.3,53.22) v1(41.4,53.73)
DIG2: length 13
  Top Layer w0.508: LED3.8 25.85,52.52 arc(26.67,51.97) 27.65,51.78 34.16,51.78 34.31,51.92 arc(34.86,52.75) 35.05,53.72 v1(35.05,53.73)
DIG3: length 50.3
  Top Layer w0.508: v1(25.78,56.35) 33.69,56.35 arc(33.7,56.35) 33.71,56.34 v1(36.32,53.73)
  Bottom Layer w0.508: v1(25.78,56.35) 17.59,56.35 arc(17.59,56.35) 17.58,56.35 16.95,56.98 16.89,56.98 16.74,56.83 12.8,56.83 11.61,55.64 arc(11.48,55.44) 11.43,55.21 arc(11.44,55.2) 11.44,55.19 10.49,54.24 arc(10.36,54.04) 10.31,53.82 10.31,53.11 arc(10.49,52.23) 10.98,51.49 12.4,50.08 arc(12.59,49.94) 12.83,49.9 19.7,49.9 arc(20.67,49.71) 21.5,49.15 LED3.6
DIG4: length 18.8
  Bottom Layer w0.254: 44.32,54.11 44.32,52.58 arc(44.13,51.6) 43.58,50.78 43.31,50.51 32.47,50.51 arc(31.8,50.64) 31.24,51.02 U5.3
DIG5: length 13.6
  Bottom Layer w0.508: 51.94,54.11 51.21,54.84 arc(50.39,55.39) 49.42,55.59 40.89,55.59 40.88,55.57 arc(40.33,54.75) 40.13,53.77 U5.10
DIG6: length 23.3
  Bottom Layer w0.508: U5.5 33.78,54.03 arc(33.98,55) 34.53,55.82 34.93,56.22 52.36,56.22 arc(52.37,56.22) 52.38,56.22 54.48,54.11
DIG7: length 37.7
  Top Layer w0.508: LED4.6 59.58,46.16 arc(60.13,46.98) 60.33,47.95 60.33,55.21 58.55,56.98 40.87,56.98 arc(40.85,56.98) 40.84,56.97 v1(37.59,53.73)
DIN8: length 67
  Top Layer w0.254: U1.19 26.45,27.65 arc(25.88,28.02) 25.21,28.16 23.54,28.16 arc(23.24,28.28) 23.11,28.58 H2.7
  Top Layer w0.508: v1(28.7,53.73) 28.7,54.11 arc(28.57,54.77) 28.19,55.33 10.2,55.33 arc(9.22,55.14) 8.4,54.59 3.75,49.94 arc(3.25,49.61) CN2输入.3
  Bottom Layer w0.254: CN2输入.3 22.46,29.7 arc(22.76,29.5) H2.7
DOUT8: length 45.8
  Top Layer w0.254: v1(42.55,47.33) 43.53,47.33 arc(44.5,47.53) 45.32,48.08 46.23,48.98 arc(46.51,49.17) 46.84,49.24 v1(58.55,49.24) ; v1(40.77,46.83) 41.89,45.71 arc(41.93,45.67) v1(41.99,45.66) ; v1(27.81,46.22) 28.06,46.46 arc(28.88,47.01) 29.86,47.21 v1(30.61,47.21) ; 68.48,49.24 v1(61.72,49.24)
  Bottom Layer w0.254: v1(42.55,47.33) 42.55,47 arc(42.4,46.28) v1(41.99,45.66) ; U5.24 27.81,45.13 v1(27.81,46.22) ; v1(58.55,49.24) v1(61.72,49.24) ; v1(30.61,47.21) 40.39,47.21 v1(40.77,46.83)
ISET8: length 4.6
  Bottom Layer w0.254: R19.2 35.55,41.47 arc(35.65,41.98) 35.94,42.4 arc(36.22,42.83) 36.32,43.33 U5.18
L1_2: length 16
  Top Layer w0.508: U3.1 83.75,17.36
  Top Layer w1.016: D1.1 80.31,7.09 arc(81.13,7.64) 82.1,7.84 v1(82.46,7.84)
  Bottom Layer w1.016: v1(82.46,7.84) 82.92,7.84 arc(83.75,8) 84.46,8.47 84.46,15.46 arc(84.27,16.38) v1(83.75,17.15)
  vias: v1(82.46,8.91)
LOAD8: length 108.6
  Top Layer w0.254: v1(13.72,35.9) 16.86,35.9 arc(17.83,35.71) 18.65,35.16 v1(19.56,34.25) ; v1(41.07,48.98) 41.97,49.89 arc(42.4,50.52) v1(42.55,51.27) arc(42.66,51.25) 42.76,51.18 v1(44.45,49.49) ; v1(38.86,48.98) 5.75,48.98 arc(4.78,48.79) 3.95,48.24 CN2输入.2 ; U1.18 25.85,28.95 arc(25.71,29.17) H2.8
  Bottom Layer w0.254: v1(19.56,34.25) 19.78,34.25 arc(20.75,34.06) 21.57,33.51 H2.8 ; v1(38.86,48.98) v1(41.07,48.98) ; 68.71,46.7 48.3,46.7 arc(47.32,46.89) 46.5,47.44 v1(44.45,49.49) ; CN2输入.2 13.41,36.21 arc(13.61,36.08) 13.84,36.03 ; v1(42.67,53.73) 42.67,51.58 arc(42.64,51.41) v1(42.55,51.27)
NRST: length 36.6
  Top Layer w0.254: U1.7 34.58,24.1 arc(34.39,23.81) v1(34.32,23.46) ; SW1.2 25.05,19.01 arc(25.3,19.12) 25.4,19.37 v1(25.4,19.65) 25.4,22.6 arc(25.54,22.94) 25.87,23.08 26.16,23.08 arc(26.43,23.19) 26.54,23.46 26.54,24.79 arc(26.45,25.26) 26.18,25.66 v1(26.16,25.68) 25.38,26.47 arc(24.77,26.87) 24.06,27.01 16.64,27.01 arc(15.83,27.35) 15.49,28.16 H2.4
  Bottom Layer w0.254: 26.92,19.05 26.81,18.94 R14.1 v1(25.4,19.65) ; v1(26.16,25.68) 29.14,25.68 arc(29.55,25.51) 29.72,25.11 29.72,23.47 arc(29.88,23.08) 30.26,22.92 33.47,22.92 arc(33.76,22.98) 34,23.14 v1(34.32,23.46)
OSC32_IN: length 30.1
  Top Layer w0.254: U1.3 37.34,24.03 arc(37.49,24.13) 37.67,24.17 v1(38.59,24.17) 38.97,24.17 arc(39.27,24.11) 39.52,23.94 40.01,23.45 arc(40.19,23.18) 40.26,22.86 40.26,20.02 arc(40.3,19.79) 40.44,19.6 40.73,19.3 arc(40.91,19.18) 41.12,19.14 arc(41.43,19.08) 41.69,18.9 41.91,18.69 42.26,19.04 arc(42.54,19.23) 42.88,19.29 44.01,19.29 arc(44.32,19.16) 44.45,18.85 X5.1 ; H2.18 51.05,27.39 arc(50.94,27.12) 50.68,27.01 42.22,27.01 arc(42.05,26.98) v1(41.91,26.89)
  Bottom Layer w0.254: v1(38.59,24.17) 38.59,26 arc(38.7,26.27) 38.96,26.38 41.14,26.38 arc(41.38,26.43) 41.59,26.56 v1(41.91,26.89)
OSC32_OUT: length 27.9
  Top Layer w0.254: v1(41.15,27.01) 41.3,27.16 arc(41.58,27.35) 41.92,27.42 47.63,27.42 arc(48.25,27.68) 48.51,28.31 H2.17 ; U1.4 37.21,24.61 arc(37.34,24.7) 37.49,24.73 v1(37.84,24.73) 38.85,24.73 arc(39.21,24.66) 39.52,24.45 40.44,23.53 arc(40.57,23.34) 40.61,23.1 40.61,20.26 arc(40.65,20.07) 40.76,19.91 40.9,19.77 arc(41.03,19.68) 41.2,19.65 arc(41.63,19.78) C28.2 42.17,19.88 arc(42.43,19.71) 42.73,19.65 44.03,19.65 arc(44.33,19.77) 44.45,20.07 X5.2
  Bottom Layer w0.254: v1(41.15,27.01) 38.33,27.01 arc(37.99,26.87) 37.84,26.53 v1(37.84,24.73)
OSC_IN: length 10.9
  Top Layer w0.254: X3.1 45.37,23.04 44.69,23.72 arc(44.42,23.9) 44.09,23.97 42.76,23.97 ; U1.5 36.93,25.03 arc(37.18,25.2) 37.47,25.26 39.35,25.26 arc(39.7,25.19) 40,24.99 40.72,24.27 arc(40.92,24.14) 41.15,24.09 arc(41.36,24.05) 41.55,23.92 C34.1 42,23.65 arc(42.34,23.88) 42.76,23.97 ; 42.61,23.97 42.76,23.97
OSC_OUT: length 9.3
  Top Layer w0.254: X3.3 42.97,24.47 42.69,24.47 arc(42.51,24.51) 42.36,24.61 C33.2 41.41,24.56 arc(41.32,24.49) 41.21,24.47 arc(41.04,24.51) 40.89,24.61 40.12,25.37 arc(39.85,25.55) 39.53,25.62 37.15,25.62 arc(36.83,25.55) 36.56,25.37 35.82,24.63
PA0: length 13.5
  Top Layer w0.254: H2.16 45.97,28.48 arc(45.78,28.02) 45.32,27.83 41.37,27.83 arc(40.86,27.72) 40.43,27.43 40.25,27.26 arc(39.7,26.89) 39.04,26.76 35.28,26.76 arc(35.13,26.73) 35,26.64 U1.10
PA1: length 43.8
  Top Layer w0.254: U1.11 34.68,27.03 arc(34.94,27.2) 35.26,27.27 39.14,27.27 arc(39.59,27.36) 39.96,27.61 arc(40.6,28.03) 41.35,28.18 42.97,28.18 arc(43.3,28.32) 43.43,28.65 H2.15
  Bottom Layer w0.254: 72.01,40.48 57.43,40.48 arc(56.58,40.31) 55.86,39.82 arc(54.92,39.2) 53.81,38.98 44.85,30.01 arc(44.2,29.58) H2.15
PA2: length 44.6
  Top Layer w0.254: U1.12 34.29,27.34 arc(34.62,27.57) 35.02,27.65 38.31,27.65 arc(39.05,27.8) 39.69,28.22 H2.14
  Bottom Layer w0.254: OLED1.4 59.6,43.02 arc(58.63,42.82) 57.8,42.27 55.61,40.08 arc(54.78,39.53) 53.81,39.33 51.85,39.33 arc(50.88,39.14) 50.06,38.59 H2.14
PA3: length 33.2
  Top Layer w0.254: U1.13 31.8,26.98 arc(32.12,27.19) 32.49,27.27 32.98,27.27 arc(33.49,27.37) 33.91,27.65 34.12,27.86 arc(34.45,28.08) 34.84,28.16 36.49,28.16 arc(37.04,28.26) 37.5,28.57 H2.13
  Bottom Layer w0.254: H2.13 38.35,33.04 arc(38.16,34.01) 37.61,34.84 36.92,35.53 arc(36.65,35.71) U7.2 31.38,35.78 arc(30.64,35.92) v1(30.02,36.34) 26.76,39.6 arc(25.93,40.15) 24.96,40.35 22.23,40.35 arc(21.87,40.28) 21.57,40.08 U6.2
PA4: length 27.6
  Top Layer w0.254: 31.23,26.4 30.73,26.9 arc(30.64,27.03) 30.61,27.19 arc(30.64,27.38) 30.75,27.54 30.9,27.69 arc(31.14,27.85) 31.41,27.9 33.08,27.9 arc(33.49,27.98) 33.85,28.22 34,28.38 arc(34.32,28.59) 34.7,28.66 arc(35.02,28.73) 35.3,28.92 H2.12 ; v1(39.12,33.62) 38.55,33.05 arc(38.05,32.72) v1(37.47,32.6)
  Bottom Layer w0.254: v1(37.47,32.6) 36.56,31.69 arc(36.01,30.87) 35.81,29.9 H2.12 ; v1(51.15,40.35) 45.16,34.36 arc(44.34,33.81) 43.37,33.62 v1(39.12,33.62)
PA5: length 5.5
  Top Layer w0.254: H2.11 32.43,28.58 arc(32.07,28.34) 31.65,28.26 31.29,28.26 arc(31.02,28.21) 30.79,28.08 arc(30.76,28.05) 30.73,28.03 30.27,27.56 arc(30.16,27.4) 30.12,27.2 30.12,27.02 arc(30.16,26.82) 30.27,26.65 U1.15
PA6: length 4.5
  Top Layer w0.254: U1.16 29.86,26.35 arc(29.66,26.65) 29.59,27 29.59,27.82 arc(29.68,28.25) 29.92,28.61 H2.10
PA8: length 14
  Top Layer w0.254: U1.29 25.97,16.19 18.81,16.19 arc(18.26,15.97) 18.03,15.42 H5.16
PA9/USART1_TX: length 11.5
  Top Layer w0.254: U1.30 26.32,15.84 21.27,15.84 arc(20.78,15.63) 20.57,15.15 H5.15
PA10/USART1_RX: length 9.1
  Top Layer w0.254: U1.31 26.64,15.46 23.6,15.46 arc(23.26,15.31) 23.11,14.97 H5.14
PA13/SWDIO: length 36
  Top Layer w0.254: H1.3 52.83,20.54 arc(52.47,20.39) 52.32,20.03 52.32,16.28 arc(52.12,15.79) 51.63,15.58 50.31,15.58 arc(49.94,15.43) 49.78,15.05 49.78,13.55 arc(49.52,12.92) 48.9,12.66 30.12,12.66 arc(29.66,12.86) 29.46,13.32 29.46,15.68 arc(29.55,16.12) 29.8,16.49 U1.34
PA14/SWCLK: length 55.8
  Top Layer w0.254: v1(30.99,23.46) 30.99,23.08 arc(31.08,22.61) 31.35,22.21 32.56,21 arc(32.83,20.64) 33.01,20.23 arc(33.03,20.12) 33.05,20.01 arc(33.06,19.89) 33.07,19.77 33.07,17.67 arc(33.1,17.5) 33.2,17.36 U1.37 ; v1(29.46,30.44) 29.46,31.12 arc(29.68,31.63) 30.19,31.84 56.4,31.84 arc(57.2,31.51) 57.53,30.71 57.53,23.86 arc(57.3,23.31) 56.74,23.08 H1.2
  Bottom Layer w0.254: v1(29.46,30.44) 29.46,29.48 arc(29.5,28.47) 29.63,27.46 arc(30.14,25.4) v1(30.99,23.46)
PA15: length 6.6
  Top Layer w0.254: U1.38 34.55,16.71 arc(34.64,16.58) 34.67,16.42 arc(34.63,16.23) 34.53,16.08 34.22,15.77 arc(34.02,15.63) 33.77,15.58 31.2,15.58 arc(30.87,15.45) 30.73,15.12 H5.11
PB3: length 4.4
  Top Layer w0.254: H5.10 34.91,15.82 arc(35.11,16.12) 35.18,16.47 arc(35.12,16.77) 34.95,17.02 U1.39
PB4: length 19
  Top Layer w0.254: U1.40 35.44,17.23 arc(35.72,16.82) 35.81,16.34 H5.9
  Bottom Layer w0.254: H5.9 35.81,10.83 arc(35.62,9.86) 35.07,9.04 32.95,6.91 K1.2
PB5: length 20.8
  Top Layer w0.254: H5.8 38.35,14.24 arc(38.21,14.97) 37.79,15.59 U1.41
  Bottom Layer w0.254: K2.2 K2.1 39.1,10.16 arc(38.55,10.98) 38.35,11.95 H5.8
PB6: length 7.6
  Top Layer w0.254: H5.7 40.89,14.84 arc(40.77,15.14) 40.47,15.27 39.49,15.27 arc(38.87,15.39) 38.35,15.75 U1.42
PB7: length 10.2
  Top Layer w0.254: 35.82,18.98 38.6,16.2 arc(39.23,15.78) 39.98,15.63 43.04,15.63 arc(43.32,15.51) 43.43,15.23 H5.6
PB8: length 26.2
  Top Layer w0.254: U1.45 39.8,16.42 arc(40.26,16.11) 40.8,16 45.2,16 arc(45.75,15.77) 45.97,15.23 H5.5 ; v1(49.15,8.98) v1(51.94,8.98)
  Bottom Layer w0.254: H12.3 53.83,8.23 arc(53.01,8.79) 52.03,8.98 v1(51.94,8.98) ; H5.5 45.97,13.21 arc(46.17,12.23) 46.72,11.41 v1(49.15,8.98)
PB9: length 24.4
  Top Layer w0.254: H5.4 48.51,15.51 arc(48.24,16.16) 47.59,16.43 41.05,16.43 arc(40.53,16.54) 40.08,16.84 U1.46
  Bottom Layer w0.254: H5.4 48.51,12.06 arc(48.71,11.09) 49.26,10.27 H12.4
PB10: length 31.7
  Top Layer w0.254: U1.21 28.17,24.51 28.17,25.26 26.14,27.29 arc(25.57,27.67) 24.91,27.8 21.07,27.8 arc(20.72,27.95) 20.57,28.3 H2.6
  Bottom Layer w0.508: U8.2 14.19,34.76 arc(15.16,34.57) 15.98,34.02 H2.6
PB11: length 30.7
  Top Layer w0.254: H2.5 18.03,27.88 arc(18.18,27.54) 18.52,27.39 24.64,27.39 arc(25.23,27.28) 25.72,26.95 27.76,24.91 27.76,24.21 U1.22
  Bottom Layer w0.508: U8.3 14.19,32.22 arc(15.16,32.03) 15.98,31.48 H2.5
PB12: length 37.5
  Top Layer w0.254: H5.20 7.87,14.98 arc(8.12,15.59) 8.73,15.84 12.75,15.84 arc(13.29,15.95) 13.75,16.25 14.55,17.05 arc(15.17,17.47) 15.91,17.62 24.56,17.62 U1.25
  Bottom Layer w0.254: K3.1 K3.2 8.62,8.53 arc(8.07,9.35) 7.87,10.32 H5.20
PB13: length 20.5
  Top Layer w0.254: H5.19 10.41,14.84 arc(10.59,15.28) 11.03,15.46 13.24,15.46 arc(13.8,15.57) 14.27,15.88 15.1,16.71 arc(15.7,17.12) 16.42,17.26 24.91,17.26 U1.26
PB14: length 31.7
  Top Layer w0.254: U1.27 25.26,16.9 17.27,16.9 arc(16.38,16.73) 15.63,16.22 14.04,14.64 arc(13.54,14.3) H5.18
  Bottom Layer w0.254: K4.2 K4.1 13.7,6.98 arc(13.15,7.81) 12.95,8.78 H5.18
PB15: length 15.5
  Top Layer w0.254: U1.28 25.61,16.55 18.54,16.55 arc(17.91,16.42) 17.37,16.06 H5.17
PC13: length 38.5
  Top Layer w0.254: v1(33.4,23.46) 33.99,22.86 arc(34.32,22.65) 34.71,22.57 36.46,22.57 arc(36.57,22.59) 36.67,22.66 37.24,23.22 ; H2.19 53.59,30.41 arc(53.47,30.7) 53.18,30.82 34.93,30.82 arc(34.66,30.71) v1(34.54,30.44)
  Bottom Layer w0.254: v1(33.4,23.46) 33.35,23.51 arc(33.01,24.01) 32.89,24.61 32.89,25.53 arc(33.03,26.2) 33.4,26.76 33.49,26.85 arc(33.73,27.11) 33.94,27.39 arc(34.39,28.35) 34.54,29.39 v1(34.54,30.44) ; H2.19 52.59,28.43 arc(52.11,27.71) 51.94,26.85 51.94,24.98 arc(51.85,24.76) 51.64,24.68 51.18,24.68
R1_1: length 2.1
  Top Layer w0.508: R1.1 78.45,1.85 arc(78.43,1.79) R17.1
R2_1: length 2.2
  Top Layer w0.508: G1.1 74.71,3.83 arc(74.71,3.87) R2.1
R6_2: length 7.6
  Top Layer w0.508: v1(77.6,15.27) 79.25,15.27 arc(79.32,15.28) v1(79.38,15.32) ; R6.2 v1(81.92,17.14) 81.92,16.27 arc(81.91,16.17) U3.3
  Bottom Layer w0.508: v1(79.38,15.32) 80.68,16.63 arc(81.25,17.01) v1(81.92,17.14)
SEGA8: length 53.8
  Bottom Layer w0.254: 42.73,49.07 44.01,50.35 arc(44.61,51.18) 44.9,52.16 46.86,54.11 ; 42.73,49.07 42.65,49.15 arc(41.83,49.71) 40.86,49.9 32.47,49.9 arc(31.62,50.06) 30.89,50.51 12.83,50.51 11.67,51.67 arc(11.12,52.49) 10.92,53.47 10.96,53.5 10.96,53.85 13.34,56.22 14.52,56.22 arc(14.53,56.22) 14.54,56.22 LED3.11 ; 42.73,49.07 42.15,48.48 arc(41.6,47.66) 41.4,46.69 v1(41.4,44.24)
SEGB8: length 65.2
  Top Layer w0.254: v1(38.86,40.35) 47.95,40.35 arc(48.86,40.53) 49.64,41.05 arc(50.41,41.56) 51.33,41.75 52.96,41.75 arc(53.09,41.94) 53.14,42.18 53.14,44.94 arc(53.33,45.91) 53.88,46.73 v1(55.37,48.22)
  Bottom Layer w0.254: LED4.7 57.02,50.93 arc(56.83,49.95) 56.28,49.13 v1(55.37,48.22) ; v1(38.86,44.24) v1(38.86,40.35)
  Bottom Layer w0.508: LED3.7 26.8,54.36 arc(26.99,55.33) 27.54,56.16 28.45,57.07 54.05,57.07 arc(54.07,57.06) 54.08,57.05 57.02,54.11
SEGC8: length 46.4
  Top Layer w0.254: 51.94,43.85 49.94,41.85 arc(49.12,41.3) 48.15,41.11 23.11,41.11 21.65,42.57 21.65,43.7 arc(21.67,43.78) LED3.4
  Top Layer w0.508: LED3.4 22.67,44.81 arc(23.5,45.36) 24.47,45.56 32.39,45.56 33.64,44.3 arc(33.71,44.26) v1(33.78,44.24)
SEGD8: length 39.1
  Bottom Layer w0.254: LED3.2 17.88,42.62 arc(18.7,42.07) 19.67,41.87 29.46,41.87 arc(29.84,42.43) 29.97,43.1 U5.23 arc(30.08,43.7) 30.39,43.23 32.4,41.22 arc(32.95,40.39) 33.15,39.42 33.15,38.19 arc(33.35,38.06) 33.58,38.01 39.54,38.01 arc(40.51,38.2) 41.33,38.75 v1(41.66,39.08) 45.69,43.12 arc(46.23,43.47) LED4.2
SEGDP8: length 44.6
  Top Layer w0.254: LED4.3 48.93,43.12 arc(48.1,42.57) 47.13,42.38 41.02,42.38 arc(40.82,42.69) 40.74,43.05 v1(40.74,46.06) ; v1(38.99,46.06) arc(38.33,46.19) 37.78,46.57 36.32,48.02 25.38,48.02 arc(25.05,47.83) v1(24.77,47.59)
  Top Layer w0.508: v1(24.77,47.59) 24.04,47.59 arc(23.07,47.39) 22.24,46.84 v1(21.72,46.32)
  Bottom Layer w0.254: v1(38.99,46.06) v1(40.74,46.06)
  Bottom Layer w0.508: LED3.3 21.59,46.26 arc(21.65,46.3) v1(21.72,46.32) ; v1(24.77,47.59) 27.75,47.59 arc(28.72,47.39) 29.55,46.84 30.6,45.79 arc(31.08,45.08) U5.22
SEGE8: length 42.3
  Top Layer w0.254: v1(30.46,42.18) 31.46,42.18 arc(31.95,42.28) v1(32.35,42.55) ; v1(35.29,42.52) 35.04,42.52 34.42,43.14 33.27,43.14 33.05,42.92 v1(33.05,42.79)
  Bottom Layer w0.254: 32.51,44.1 U5.21 ; 32.51,44.1 32.51,43.17 arc(32.47,42.85) v1(32.35,42.55) ; 32.51,44.1 arc(32.65,43.39) v1(33.05,42.79) ; LED3.1 15.69,42.26 arc(16.51,41.71) 17.49,41.52 29.46,41.52 arc(29.6,41.54) 29.72,41.62 29.98,41.88 arc(30.2,42.06) v1(30.46,42.18) ; LED4.1 43.85,43.12 arc(43.02,42.57) 42.05,42.38 v1(39.62,42.38) 39.62,40.2 arc(39.68,39.94) 39.83,39.71 arc(39.86,39.65) 39.88,39.59 39.61,39.31 arc(38.78,38.76) 37.81,38.57 35.56,38.57 34.8,39.33 34.8,41.34 arc(34.93,41.98) v1(35.29,42.52)
SEGF8: length 39.3
  Top Layer w0.254: v1(40.13,44.24) 40.13,49.58 arc(40.33,50.55) 40.88,51.38 41.53,52.03 47.58,52.03 LED4.10 ; LED3.10 22.29,51 arc(23.12,50.45) 24.09,50.25 40.13,50.25
SEGG8: length 35.5
  Top Layer w0.254: v1(45.21,41.64) 45.19,41.62 38.15,41.62 37.62,44.22 v1(37.59,44.24) 37.59,44.19 arc(37.4,43.22) 36.85,42.4 36.08,41.63 27.53,41.63 27.16,42 arc(26.19,42.19) 25.37,42.74 LED3.5
  Bottom Layer w0.254: LED4.5 53.63,42.74 arc(52.8,42.19) 51.83,42 51.47,41.64 v1(45.21,41.64)
U1_2: length 4.3
  Top Layer w0.508: 90.31,18.54 90.31,19.37 arc(90.34,19.52) 90.42,19.65 92.08,19.65 arc(92.26,19.93) 92.33,20.26 R3.2
U1_4: length 49.1
  Top Layer w0.508: G1.2 77.32,0.73 arc(77.33,0.73) 77.33,0.72 79.88,0.72 arc(79.97,0.85) 80,1 R17.2 80.55,1.74 arc(80.55,1.74) 80.56,1.74 arc(80.56,1.74) 80.56,1.74 v1(81.82,1.74) ; U4.8 91.63,12.33 arc(91.67,11.86) 91.81,11.41 arc(91.79,11.39) v1(91.82,11.39) arc(92.05,11) v1(92.33,10.63) ; U4.4 arc(88.07,18.96) 88.15,19.4 v1(88.15,20.79) 88.15,22.14 arc(88.07,22.58) v1(87.82,22.95)
  Bottom Layer w1.016: v1(92.33,10.63) 92.89,10.63 arc(92.99,10.62) 93.09,10.58 ; v1(87.82,22.95) 87.82,21.6 arc(87.91,21.16) v1(88.15,20.79) 88.43,20.52 arc(89.25,19.97) 90.22,19.77 91.57,19.77 93.22,18.12 93.22,11.32 ; 93.22,11.32 93.22,10.49 arc(93.16,10.54) 93.09,10.58 ; 93.22,11.32 arc(93.13,11.17) 93.09,11 93.09,10.58 ; 93.09,10.58 93.2,10.48 93.2,4.64 92.82,4.26 arc(92,3.71) 91.02,3.52 84.33,3.52 83.6,2.79 arc(83,2.39) v1(82.3,2.25)
  vias: v1(82.3,1.23)
U1_6: length 21.9
  Top Layer w0.508: v1(89.15,11.14) 89.15,12.6 arc(89.14,12.69) U4.6
  Bottom Layer w0.508: v1(76.19,3.9) 76.46,4.17 arc(77.29,4.72) 78.26,4.92 83.19,4.92 83.59,5.32 arc(83.99,5.58) 84.46,5.68 86.96,5.68 arc(88.12,5.87) 89.15,6.44 89.2,6.48 arc(89.99,7.01) 90.93,7.2 90.93,8.31 arc(90.74,9.28) 90.19,10.1 v1(89.15,11.14)
U1_7: length 20
  Top Layer w0.508: U4.7 90.36,11.74 arc(90.41,11.48) v1(90.55,11.27)
  Bottom Layer w0.508: v1(79.95,3.87) 82.33,3.87 arc(83.21,4.04) 83.95,4.53 89.75,4.53 arc(90.73,4.73) 91.55,5.28 91.82,5.55 91.82,8.94 arc(91.63,9.92) 91.08,10.74 v1(90.55,11.27)
USB1_1: length 11.1
  Top Layer w0.508: USB2.1 93.98,14.61 arc(93.93,14.36) 93.78,14.14 arc(93.64,13.92) 93.59,13.67 SW3.2
USB_5V: length 23
  Top Layer w0.254: SW3.4 96.44,0.68
  Top Layer w0.508: v1(85.29,1.74) 89.06,1.74 arc(89.16,1.76) 89.24,1.81 ; 96.44,2.98 96.44,0.68 ; 89.24,2.98 89.24,1.81 ; 89.24,1.81 SW3.4
  Top Layer w1.016: SW3.1 85.84,4.08 arc(85.78,4.06) 85.72,4.03 arc(85.4,3.55) 85.29,2.98 v1(85.29,1.74)
  vias: v1(84.84,2.25) v1(84.84,1.23)
USB_D+_PA12: length 39.6
  Top Layer w0.229: H5.12 28.18,14.19 27.64,14.72 27.64,15.15 29.73,17.24 29.84,17.24 U1.33 31.17,18.57 arc(31.38,18.71) v1(31.62,18.76) ; USB1.6 13.07,22.06 arc(13.22,21.99) 13.28,21.84 13.28,21.26 arc(13.22,21.12) 13.08,21.06 USB1.8 11.64,21.06 11.57,21.13 11.26,21.13 v1(11.05,20.92)
  Bottom Layer w0.229: 14.53,20.79 14.22,20.79 12.22,22.8 9.99,22.8 9.55,22.36 9.55,21.4 10.03,20.92 v1(11.05,20.92) ; 14.53,20.79 14.53,21.78 R11.1 ; 14.53,20.79 31.15,20.79 32.02,19.92 32.02,19.15 v1(31.62,18.76)
USB_D-_PA11: length 54.1
  Top Layer w0.229: USB1.7 11.64,21.56 11.57,21.48 11.24,21.48 v1(11.05,21.68) 10.74,21.68 arc(10.62,21.73) 10.58,21.84 10.58,22.34 arc(10.64,22.49) 10.79,22.56 USB1.5 ; H5.13 25.95,13.89 26.67,13.89 26.96,14.18 26.96,14.97 29.49,17.5 29.49,17.6 U1.32 30.78,18.88 arc(30.93,19.12) v1(30.99,19.39)
  Bottom Layer w0.229: v1(11.05,21.68) 11.05,21.65 10.67,21.27 10.18,21.27 9.91,21.55 9.91,22.21 10.13,22.44 12.07,22.44 12.2,22.31 12.2,21.84 12.45,21.59 12.92,21.59 13.17,21.34 13.17,20.87 13.42,20.62 13.89,20.62 14.08,20.43 30.99,20.43 31.66,19.76 31.66,19.44 31.48,19.26 31.12,19.26 v1(30.99,19.39) ; K5.2 K5.1 23.55,11.03 arc(23.74,12) 24.29,12.82 H5.13
$1N2054: length 17.4
  Top Layer w0.254: USB1.10 10.01,20.06 arc(9.31,20.35) 9.02,21.04 9.02,26.98 arc(9.25,27.54) 9.81,27.78 13.99,27.78 arc(14.39,27.61) 14.55,27.21 v1(14.55,26.63)
  Bottom Layer w0.254: R9.1 v1(14.55,26.63)
$1N2066: length 13
  Top Layer w0.254: USB1.4 11.45,23.06 arc(10.54,23.43) 10.16,24.35 10.16,26.63 arc(10.35,27.08) 10.8,27.27 13.34,27.27 arc(13.78,27.08) 13.97,26.63 13.97,25.06 arc(14.14,24.64) v1(14.55,24.47)
  Bottom Layer w0.254: R10.1 v1(14.55,24.47)
$1N2074: length 2.9
  Top Layer w0.254: LED1.2 50.05,17.7 arc(50.66,17.58) v1(51.18,17.23)
  Bottom Layer w0.254: R12.1 v1(51.18,17.23)
$1N2077: length 3
  Top Layer w0.254: LED2.2 50.84,26.04 arc(51.08,26.14) v1(51.18,26.38)
  Bottom Layer w0.254: R13.1 v1(51.18,26.38)
$1N3296: length 9.1
  Top Layer w0.254: H4.2 21.38,26.07 arc(21.86,26.39) 22.42,26.51 23.61,26.51 arc(24.44,26.34) 25.15,25.87 25.55,25.47 arc(25.81,25.07) v1(25.91,24.6)
  Bottom Layer w0.254: R15.2 26.92,23.77 arc(26.86,24.07) 26.7,24.32 26.64,24.38 arc(26.39,24.54) 26.1,24.6 v1(25.91,24.6)
$1N11047: length 6.3
  Top Layer w0.254: v1(25.4,23.97) 22.53,23.97 arc(21.87,23.83) 21.31,23.46 H3.2
  Bottom Layer w0.254: v1(25.4,23.97) R16.1
$1N29860: length 2.5
  Top Layer w0.508: R20.2 55.01,40.35 arc(55.09,40.36) Q1.1
$1N29960: length 12.3
  Bottom Layer w0.508: v1(55.15,38.51) 63.08,30.59 arc(63.39,30.12) BUZZER1.2
$1N30335: length 2.2
  Top Layer w0.254: R22.2 27.31,36.81 arc(27.47,37.62) LED5.2

## Copper pours and planes (outline as drawn; the poured copper is in the pictures)
3V3 on Bottom Layer: 24.89,17.36 26.54,17.36 26.54,15.84 24.89,15.84
3V3 on Bottom Layer: 19.56,18.12 19.56,17.44 19.69,16.78 20.07,16.22 25.13,16.22 25.62,16.32 26.04,16.59 26.54,17.09 26.54,17.11 26.26,17.53 26.16,18.03 26.16,18.5 21.75,18.5 21.25,18.4 20.83,18.12
+5V on Bottom Layer: 14.22,19.14 14.2,19.26 14.13,19.36 13.97,19.52 13.89,19.46 13.79,19.45 13.35,19.45 13.35,17.98 13.51,17.16 13.97,16.47 19.2,16.47 19.2,17.61 19.17,17.79 19.07,17.94 17.73,17.94 17.55,17.97 17.4,18.07 17.07,18.14 16.79,18.33 16.72,18.4 16.6,18.48 16.46,18.5 14.26,18.5 14.23,18.55 14.22,18.59
GND on Top Layer: -6.35,63.72 108.46,63.72 108.46,-13.75 -6.35,-13.75
GND on Bottom Layer: -3.94,62.06 105.66,62.06 105.66,-6.64 -3.94,-6.64

Small or netless copper shapes (teardrops, artwork), in the pictures only: 105 on Top Layer, 53 on Bottom Layer

## Text on the board
Bottom Silkscreen Layer: 刘嘉俊 | 海南大学 | 20223004426 | 2022级电子信息工程3班 | GND | 3V3 | RST | B11 | B10 | B01 | B00 | A07 | A06 | A05 | A04 | A03 | A02 | A01 | A00 | C15 | C14 | C13 | BAT | B12 | B13 | B14 | B15 | A08 | A09 | A10 | A11 | A12 | A15 | B03 | B04 | B05 | B06 | B07 | B08 | B09 | +5V | DIO | CLK
Top Silkscreen Layer: 2022级电子信息工程 | 海南大学 | 刘嘉俊 | 2022 / 3004426 | GND | B12 | B13 | 3V3 | B14 | RST | B15 | A08 | B11 | B10 | A09 | B01 | A10 | A11 | B00 | A12 | A07 | A15 | A06 | A05 | B03 | A04 | B04 | A03 | B05 | A02 | B06 | A01 | B07 | B08 | A00 | C15 | B09 | +5V | C14 | C13 | BAT | CLK | DIO | PWR | BT1 | BT0 | 0 | 1
